# Altium project LP-MSPM0G3507.PrjPcb
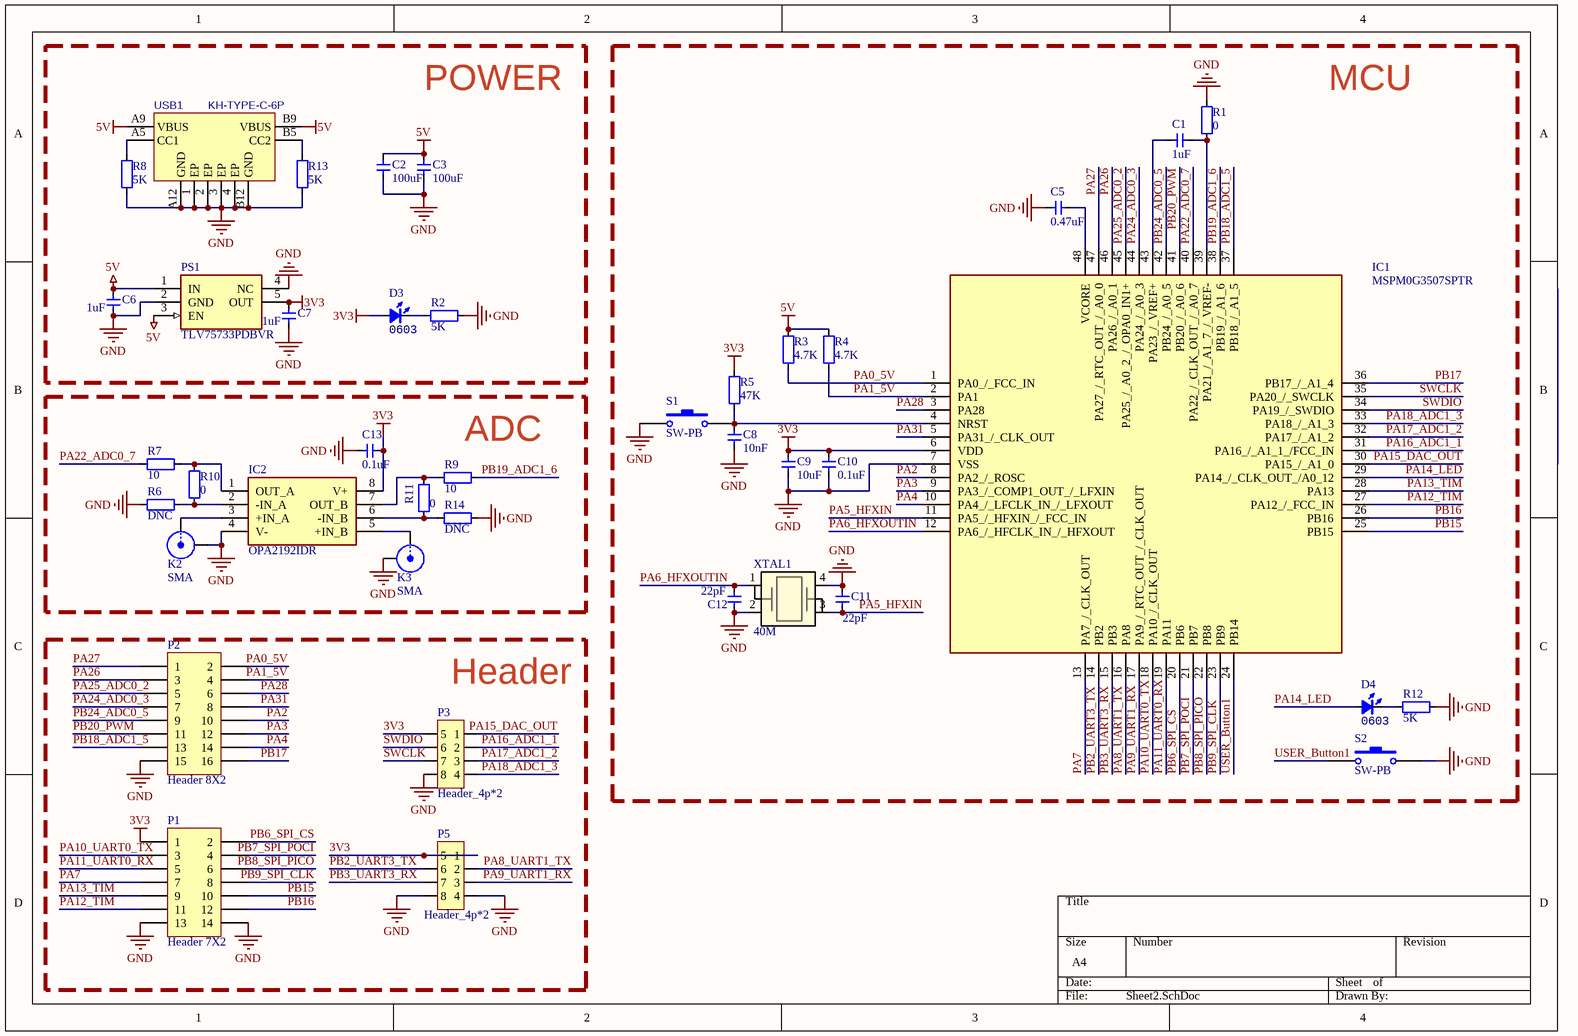
[diagram p0: Sheet2.SchDoc]
1 sheet, 41 parts. Net scope: global (net labels, ports and power ports of the same name join across sheets).
Board files: PCB1.PcbDoc, PCB2.PcbDoc

## Sheet Sheet2.SchDoc
size A4; SheetNumber: 1; SheetTotal: 1

### Parts
C1  1uF  [CAP_0402]
C2  100uF  [1206-CAP]
C3  100uF  [1206-CAP]
C5  0.47uF  [CAP_0402]
C6  1uF  [CAP_0402]
C7  1uF  [CAP_0402]
C8  10nF  [CAP_0402]
C9  10uF  [CAP_0402]
C10  0.1uF  [CAP_0402]
C11  22pF  [CAP_0402]
C12  22pF  [CAP_0402]
C13  0.1uF  [CAP_0402]
D3  Type: 0603  [0603_led]  (hidden comment: 3.3V)
D4  Type: 0603  [0603_led]  (hidden comment: 3.3V)
IC1  MSPM0G3507SPTR  [QFP50P900X900X160-48N]
IC2  OPA2192IDR  [OPA2192IDR]
K2  SMA  [SMA-W]
K3  SMA  [SMA-W]
P1  Header 7X2  [201S2X7]
P2  Header 8X2  [201S2X8]
P3  Header_4p*2  [201R2X4]
P5  Header_4p*2  [201S2X4]
PS1  TLV75733PDBVR  [SOT95P280X145-5N]
R1  0  [RES_0402]
R2  5K  [RES_0402]
R3  4.7K  [RES_0402]
R4  4.7K  [RES_0402]
R5  47K  [RES_0402]
R6  DNC  [RES_0402]
R7  10  [RES_0402]
R8  5K  [RES_0402]
R9  10  [RES_0402]
R10  0  [RES_0402]
R11  0  [RES_0402]
R12  5K  [RES_0402]
R13  5K  [RES_0402]
R14  DNC  [RES_0402]
S1  SW-PB  [KEY-K2]
S2  SW-PB  [KEY-K2]
USB1  KH-TYPE-C-6P  [TYPE-C-SMD_TYPE-C-31-M-16]
XTAL1  40M  [3225-25M]

### Blocks framed on the sheet
POWER: C2 C3 C6 C7 D3 PS1 R2 R8 R13 USB1
MCU: C1 C5 C8-C12 D4 IC1 R1 R3-R5 R12 S1 S2 XTAL1
ADC: C13 IC2 K2 K3 R6 R7 R9-R11 R14
Header: P1-P3 P5

### Nets
3V3: C7.1 C9.2 C10.2 C13.1 D3.1(A) IC1.6(VDD) IC2.8(V+) P1.1 P3.5 P5.1 P5.5 PS1.5(OUT) R5.2
5V: C2.2 C3.2 C6.1 PS1.1(IN) PS1.3(EN) R3.2 R4.2 USB1.A9(VBUS) USB1.B9(VBUS)
GND: C2.1 C3.1 C5.1 C6.2 C7.2 C8.1 C9.1 C10.1 C11.2 C12.1 C13.2 IC1.7(VSS) IC2.4(V-) K2.2(Y) K3.2(Y) P1.13 P1.14 P2.15 P3.8 P5.4 P5.8 PS1.2(GND) PS1.4(NC) R1.1 R2.1 R6.2 R8.2 R12.1 R13.2 R14.2 S1.1 S2.2 USB1.1(EP) USB1.2(EP) USB1.3(EP) USB1.4(EP) USB1.A12(GND) USB1.B12(GND) XTAL1.2 XTAL1.4
PA0_5V: IC1.1(PA0_/_FCC_IN) P2.2 R3.1
PA1_5V: IC1.2(PA1) P2.4 R4.1
PA2: IC1.8(PA2_/_ROSC) P2.10
PA3: IC1.9(PA3_/_COMP1_OUT_/_LFXIN) P2.12
PA4: IC1.10(PA4_/_LFCLK_IN_/_LFXOUT) P2.14
PA5_HFXIN: C11.1 IC1.11(PA5_/_HFXIN_/_FCC_IN) XTAL1.3
PA6_HFXOUTIN: C12.2 IC1.12(PA6_/_HFCLK_IN_/_HFXOUT) XTAL1.1
PA7: IC1.13(PA7_/_CLK_OUT) P1.7
PA8_UART1_TX: IC1.16(PA8) P5.2
PA9_UART1_RX: IC1.17(PA9_/_RTC_OUT_/_CLK_OUT) P5.3
PA10_UART0_TX: IC1.18(PA10_/_CLK_OUT) P1.3
PA11_UART0_RX: IC1.19(PA11) P1.5
PA12_TIM: IC1.27(PA12_/_FCC_IN) P1.11
PA13_TIM: IC1.28(PA13) P1.9
PA14_LED: D4.1(A) IC1.29(PA14_/_CLK_OUT_/A0_12)
PA15_DAC_OUT: IC1.30(PA15_/_A1_0) P3.1
PA16_ADC1_1: IC1.31(PA16_/_A1_1_/FCC_IN) P3.2
PA17_ADC1_2: IC1.32(PA17_/_A1_2) P3.3
PA18_ADC1_3: IC1.33(PA18_/_A1_3) P3.4
PA22_ADC0_7: IC1.40(PA22_/_CLK_OUT_/_A0_7) R7.1
PA24_ADC0_3: IC1.44(PA24_/_A0_3) P2.7
PA25_ADC0_2: IC1.45(PA25_/_A0_2_/_OPA0_IN1+) P2.5
PA26: IC1.46(PA26_/_A0_1) P2.3
PA27: IC1.47(PA27_/_RTC_OUT_/_A0_0) P2.1
PA28: IC1.3(PA28) P2.6
PA31: IC1.5(PA31_/_CLK_OUT) P2.8
PB2_UART3_TX: IC1.14(PB2) P5.6
PB3_UART3_RX: IC1.15(PB3) P5.7
PB6_SPI_CS: IC1.20(PB6) P1.2
PB7_SPI_POCI: IC1.21(PB7) P1.4
PB8_SPI_PICO: IC1.22(PB8) P1.6
PB9_SPI_CLK: IC1.23(PB9) P1.8
PB15: IC1.25(PB15) P1.10
PB16: IC1.26(PB16) P1.12
PB17: IC1.36(PB17_/_A1_4) P2.16
PB18_ADC1_5: IC1.37(PB18_/_A1_5) P2.13
PB19_ADC1_6: IC1.38(PB19_/_A1_6) R9.1
PB20_PWM: IC1.41(PB20_/_A0_6) P2.11
PB24_ADC0_5: IC1.42(PB24_/_A0_5) P2.9
SWCLK: IC1.35(PA20_/_SWCLK) P3.7
SWDIO: IC1.34(PA19_/_SWDIO) P3.6
USER_Button1: IC1.24(PB14) S2.1
NetC1_1: C1.1 IC1.43(PA23_/_VREF+)
NetC1_2: C1.2 IC1.39(PA21_/_A1_7_/_VREF-) R1.2
NetC5_2: C5.2 IC1.48(VCORE)
NetC8_2: C8.2 IC1.4(NRST) R5.1 S1.2
NetD3_2: D3.2(K) R2.2
NetD4_2: D4.2(K) R12.2
NetIC2_1: IC2.1(OUT_A) R7.2 R10.1
NetIC2_2: IC2.2(-IN_A) R6.1 R10.2
NetIC2_3: IC2.3(+IN_A) K2.1(X)
NetIC2_5: IC2.5(+IN_B) K3.1(X)
NetIC2_6: IC2.6(-IN_B) R11.2 R14.1
NetIC2_7: IC2.7(OUT_B) R9.2 R11.1
NetR8_1: R8.1 USB1.A5(CC1)
NetR13_1: R13.1 USB1.B5(CC2)

### Library data of the parts
C1 C5-C13 = 电容-0402: Capacitor; Value: 0.1u
C2 C3 = 电容-1206: Capacitor; Value: 0.1u
D3 D4 = LED_0603: LED; Value: color?
IC1 = MSPM0G3507SPTR: Integrated Circuit; Manufacturer_Name: Texas Instruments; Manufacturer_Part_Number: MSPM0G3507SDGS28R; Datasheet Link: https://www.ti.com/lit/ds/symlink/mspm0g3507.pdf; Height: 1.6mm
IC2 = OPA2192IDR: Integrated Circuit; Manufacturer_Name: Texas Instruments; Manufacturer_Part_Number: OPA2192IDR/BKN; Datasheet Link: https://www.ti.com/lit/ds/symlink/opa2192.pdf?ts=1622289663619&ref_url=https%253A%252F%252Fwww.ti.com%252Fstore%252Fti%252Fen%252Fp%252Fproduct%252F%253Fp%253DOPA2192IDR; Height: 1.75mm
P1 = Header 7X2: Header, 7-Pin, Dual row; LatestRevisionDate: 17-Jul-2002; LatestRevisionNote: Re-released for DXP Platform.; Publisher: Altium Limited
P2 = Header 8X2: Header, 8-Pin, Dual row; LatestRevisionDate: 17-Jul-2002; LatestRevisionNote: Re-released for DXP Platform.; Publisher: Altium Limited
PS1 = TLV75733PDBVR: Power Supply; Manufacturer_Name: Texas Instruments; Datasheet Link: http://www.ti.com/lit/gpn/tlv757p; Height: 1.45mm; Manufacturer_Part_Number: TLV75733PDBVR; Mouser Part Number: 595-TLV75733PDBVR; Mouser Price/Stock: https://www.mouser.co.uk/ProductDetail/Texas-Instruments/TLV75733PDBVR?qs=y6ZabgHbY%252BwAAzSntTW34w%3D%3D; Arrow Part Number: TLV75733PDBVR; Arrow Price/Stock: https://www.arrow.com/en/products/tlv75733pdbvr/texas-instruments?region=nac
R1-R14 = 电阻-0402: Resistor; Value: 22R
S1 S2 = SW-PB: Switch; Published: 24-Mar-1999; LatestRevisionDate: 17-Jul-2002; LatestRevisionNote: Re-released for DXP Platform.; PackageReference: SPST-2; Publisher: Altium Limited; PackageDescription: Switch; 2 Leads
USB1 = TYPE-C-6P: BOM_Manufacturer: Shenzhen Kinghelm Elec; Contributor: LCSC; BOM_Supplier: LCSC; BOM_Supplier Part: C709355; BOM_Manufacturer Part: KH-TYPE-C-6P; BOM_JLCPCB Part Class: Extended Part; spicePre: U; spiceSymbolName: KH-TYPE-C-6P
XTAL1 = NX3225GA-16.000M-STD-CRG-2: No Description Available; Mfr_Name: NDK; Copyright: Copyright (C) 2022 Ultra Librarian. All rights reserved.; Manufacturer_Part_Number: NX3225GA-16.000M-STD-CRG-2; RefDes: RefDes; Type: DEV